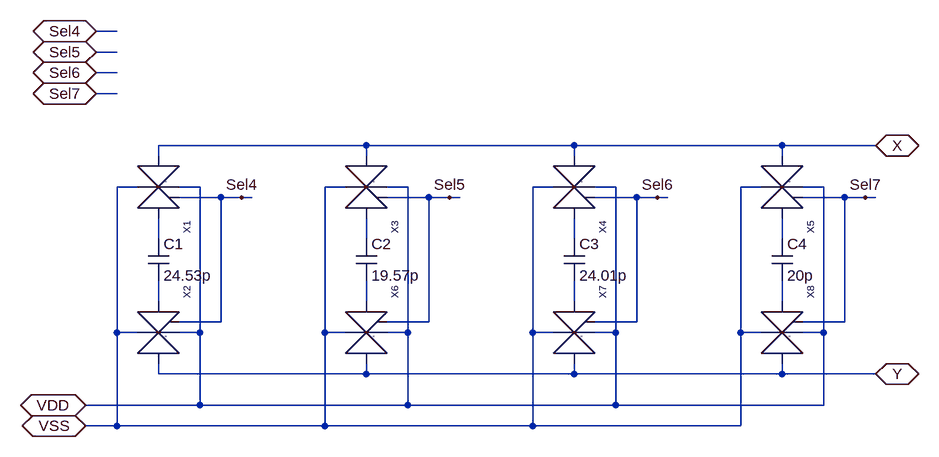
[diagram p0: schematic Cap_array2.asc]
Cap_array2.asc, the LTspice schematic file:
Version 4
SHEET 1 1264 680
WIRE 16 -32 -16 -32
WIRE 16 0 -16 0
WIRE 16 32 -16 32
WIRE 16 64 -16 64
WIRE 400 144 80 144
WIRE 720 144 400 144
WIRE 1040 144 720 144
WIRE 1184 144 1040 144
WIRE 80 160 80 144
WIRE 400 160 400 144
WIRE 720 160 720 144
WIRE 1040 160 1040 144
WIRE 48 208 16 208
WIRE 144 208 112 208
WIRE 368 208 336 208
WIRE 464 208 432 208
WIRE 688 208 656 208
WIRE 784 208 752 208
WIRE 1008 208 976 208
WIRE 1104 208 1072 208
WIRE 176 224 112 224
WIRE 208 224 176 224
WIRE 224 224 208 224
WIRE 496 224 432 224
WIRE 528 224 496 224
WIRE 544 224 528 224
WIRE 816 224 752 224
WIRE 848 224 816 224
WIRE 864 224 848 224
WIRE 1136 224 1072 224
WIRE 1168 224 1136 224
WIRE 1184 224 1168 224
WIRE 80 288 80 256
WIRE 400 288 400 256
WIRE 720 288 720 256
WIRE 1040 288 1040 256
WIRE 80 384 80 352
WIRE 400 384 400 352
WIRE 720 384 720 352
WIRE 1040 384 1040 352
WIRE 176 416 176 224
WIRE 176 416 112 416
WIRE 496 416 496 224
WIRE 496 416 432 416
WIRE 816 416 816 224
WIRE 816 416 752 416
WIRE 1136 416 1136 224
WIRE 1136 416 1072 416
WIRE 16 432 16 208
WIRE 48 432 16 432
WIRE 144 432 144 208
WIRE 144 432 112 432
WIRE 336 432 336 208
WIRE 368 432 336 432
WIRE 464 432 464 208
WIRE 464 432 432 432
WIRE 656 432 656 208
WIRE 688 432 656 432
WIRE 784 432 784 208
WIRE 784 432 752 432
WIRE 976 432 976 208
WIRE 1008 432 976 432
WIRE 1104 432 1104 208
WIRE 1104 432 1072 432
WIRE 80 496 80 480
WIRE 400 496 400 480
WIRE 400 496 80 496
WIRE 720 496 720 480
WIRE 720 496 400 496
WIRE 1040 496 1040 480
WIRE 1040 496 720 496
WIRE 1184 496 1040 496
WIRE 144 544 144 432
WIRE 144 544 -32 544
WIRE 464 544 464 432
WIRE 464 544 144 544
WIRE 784 544 784 432
WIRE 784 544 464 544
WIRE 1104 544 1104 432
WIRE 1104 544 784 544
WIRE 16 576 16 432
WIRE 16 576 -32 576
WIRE 336 576 336 432
WIRE 336 576 16 576
WIRE 656 576 656 432
WIRE 656 576 336 576
WIRE 976 576 976 432
WIRE 976 576 656 576
FLAG -16 -32 Sel4
IOPIN -16 -32 BiDir
FLAG -16 0 Sel5
IOPIN -16 0 BiDir
FLAG -16 32 Sel6
IOPIN -16 32 BiDir
FLAG -16 64 Sel7
IOPIN -16 64 BiDir
FLAG 1184 144 X
IOPIN 1184 144 BiDir
FLAG 1184 496 Y
IOPIN 1184 496 BiDir
FLAG -32 576 VSS
IOPIN -32 576 BiDir
FLAG -32 544 VDD
IOPIN -32 544 BiDir
FLAG 208 224 Sel4
FLAG 528 224 Sel5
FLAG 848 224 Sel6
FLAG 1168 224 Sel7
SYMBOL cap 64 288 R0
SYMATTR InstName C1
SYMATTR Value 24.53p
SYMBOL cap 384 288 R0
SYMATTR InstName C2
SYMATTR Value 19.57p
SYMBOL cap 704 288 R0
SYMATTR InstName C3
SYMATTR Value 24.01p
SYMBOL cap 1024 288 R0
SYMATTR InstName C4
SYMATTR Value 20p
SYMBOL tgate 112 176 R90
SYMATTR InstName X1
SYMBOL tgate 112 464 M270
SYMATTR InstName X2
SYMBOL tgate 432 176 R90
SYMATTR InstName X3
SYMBOL tgate 752 176 R90
SYMATTR InstName X4
SYMBOL tgate 1072 176 R90
SYMATTR InstName X5
SYMBOL tgate 432 464 M270
SYMATTR InstName X6
SYMBOL tgate 752 464 M270
SYMATTR InstName X7
SYMBOL tgate 1072 464 M270
SYMATTR InstName X8

The netlist it stands for:
* Cap_array2.asc
C1 N001 N005 24.53p
C2 N002 N006 19.57p
C3 N003 N007 24.01p
C4 N004 N008 20p
XX1 X N001 VDD VSS Sel4 tgate  ; pins X Y VDD VSS C
XX2 Y N005 VDD VSS Sel4 tgate  ; pins X Y VDD VSS C
XX3 X N002 VDD VSS Sel5 tgate  ; pins X Y VDD VSS C
XX4 X N003 VDD VSS Sel6 tgate  ; pins X Y VDD VSS C
XX5 X N004 VDD VSS Sel7 tgate  ; pins X Y VDD VSS C
XX6 Y N006 VDD VSS Sel5 tgate  ; pins X Y VDD VSS C
XX7 Y N007 VDD VSS Sel6 tgate  ; pins X Y VDD VSS C
XX8 Y N008 VDD VSS Sel7 tgate  ; pins X Y VDD VSS C
.backanno
.end